# Altium project ltk-hall-main.PrjPCB (part 1 of 2)
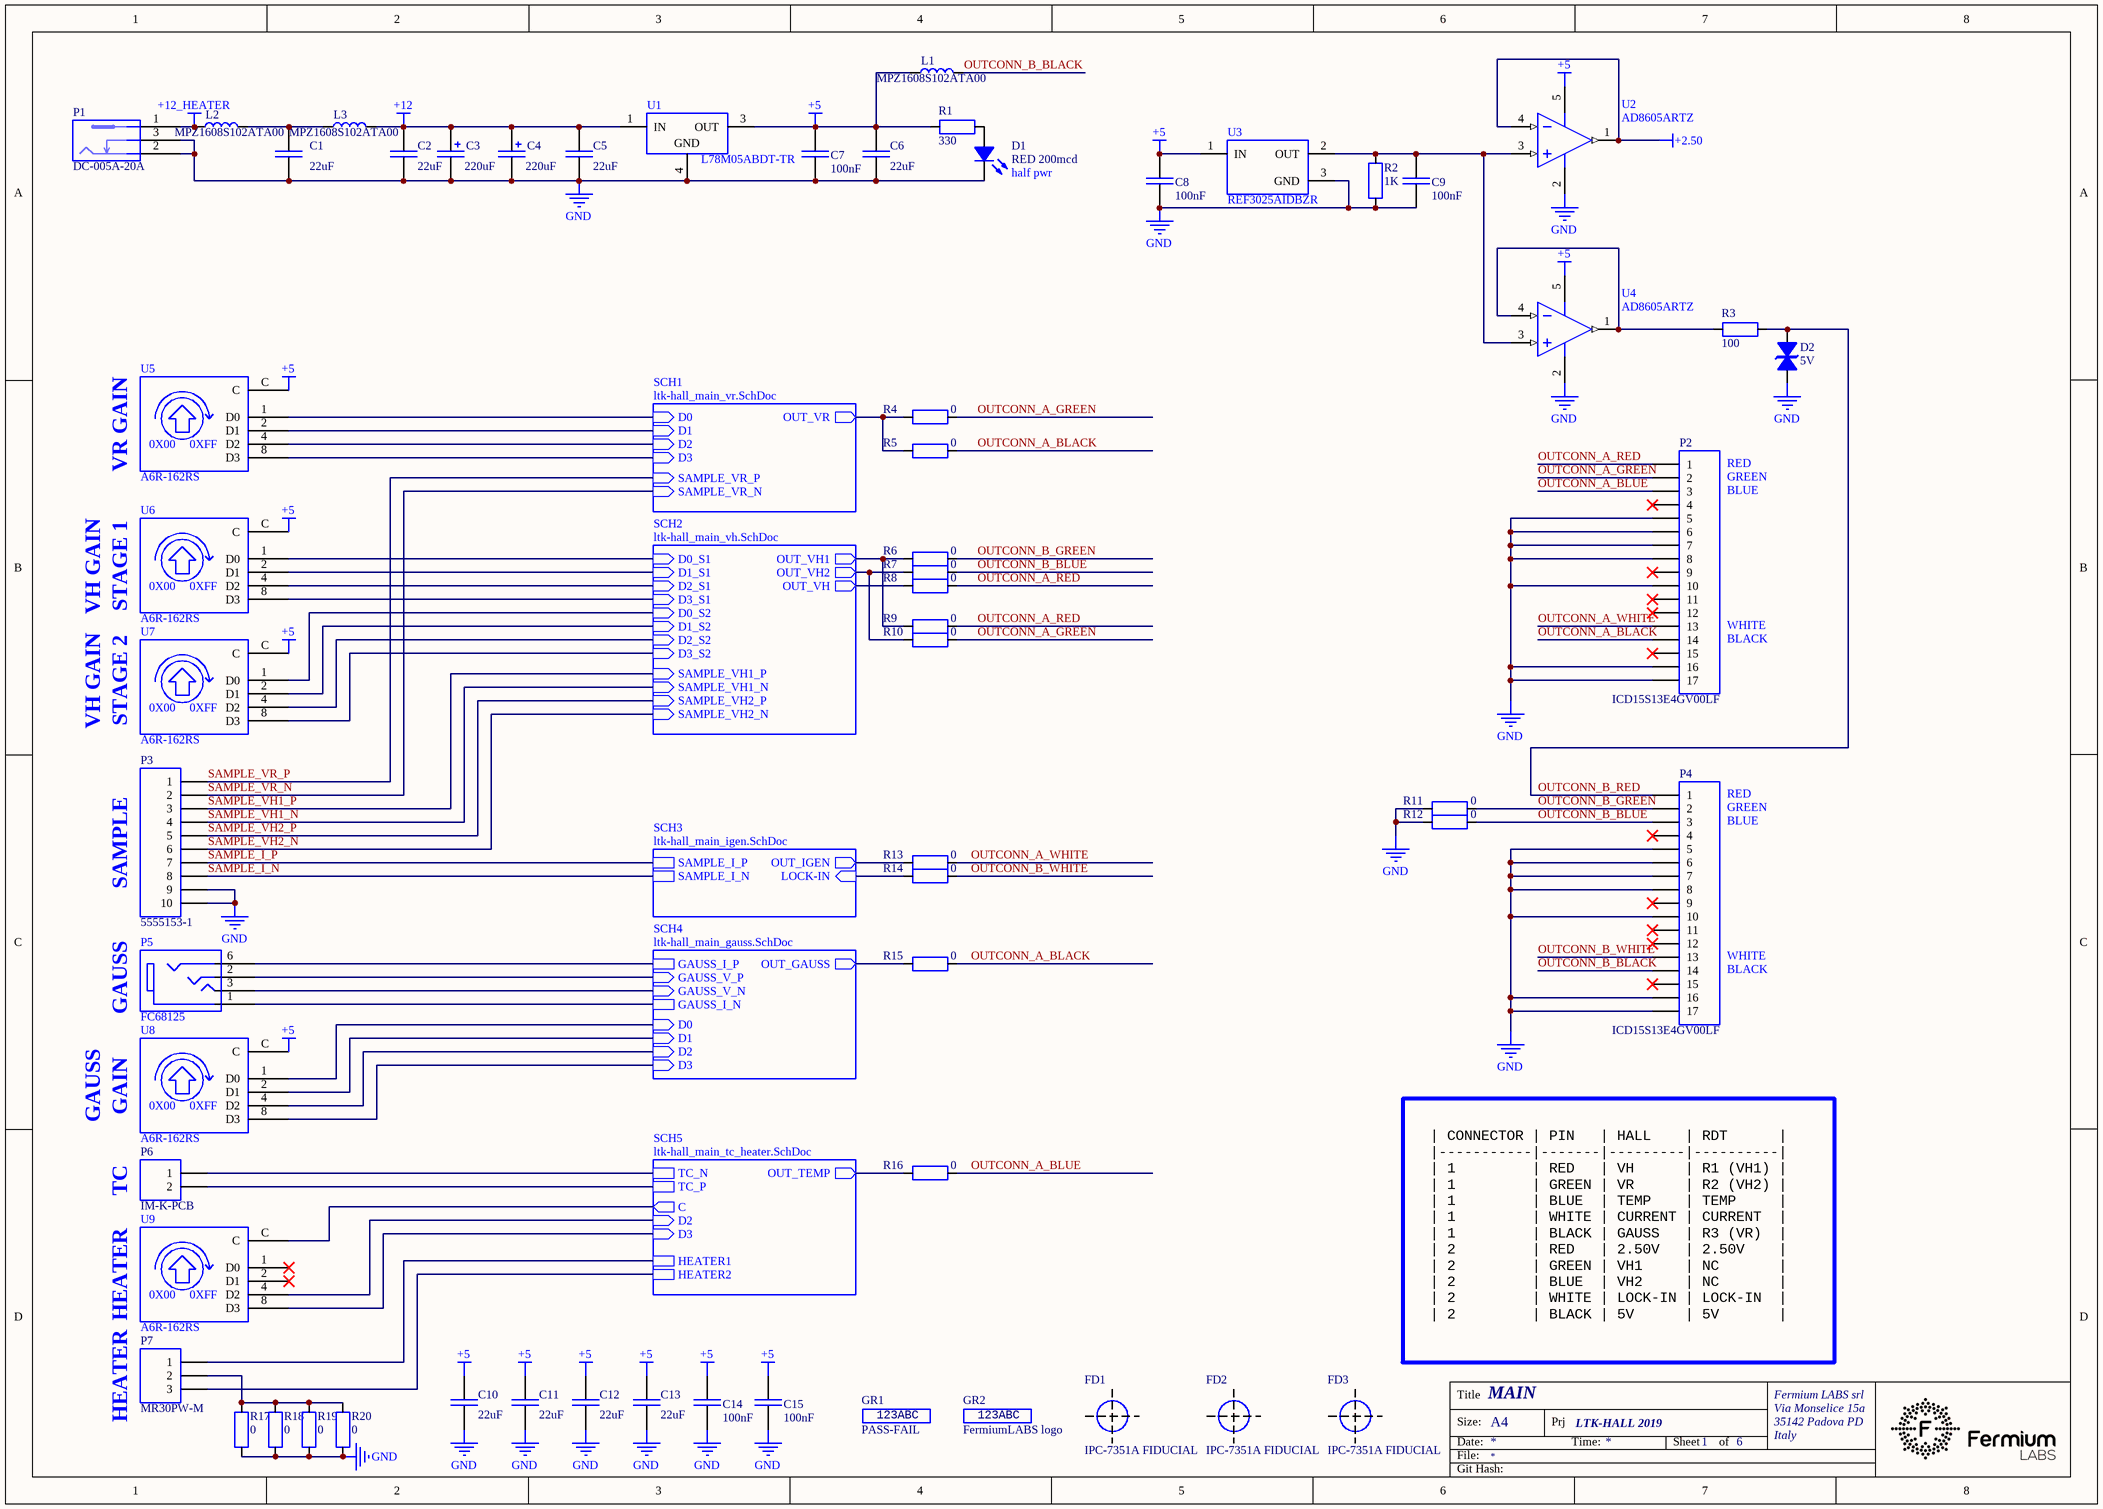
[diagram p0: ltk-hall_main.SchDoc]
ProjectTitle: LTK-HALL 2019
6 sheets, 210 parts. Net scope: hierarchical (ports join the sheet entries above them; power ports are global).
Board file: ltk-hall-main.PcbDoc
Sheets:
  ltk-hall_main.SchDoc
    SCH3 = ltk-hall_main_igen.SchDoc
    SCH4 = ltk-hall_main_gauss.SchDoc
    SCH2 = ltk-hall_main_vh.SchDoc
    SCH5 = ltk-hall_main_tc_heater.SchDoc
    SCH1 = ltk-hall_main_vr.SchDoc

## Sheet ltk-hall_main.SchDoc: MAIN
size A3; Organization: Altium Limited; Address1: L3, 12a Rodborough Rd; Address2: Frenchs Forest; Address3: NSW; Address4: Australia 2086; DocumentNumber: 1; SheetNumber: 1; SheetTotal: 6

### Parts
C1  22uF  [CAP 0805_2012]
C2  22uF  [CAP 0805_2012]
C3  220uF  [3924B366-8672-45E9-B0BE-62DACC24E783]
C4  220uF  [3924B366-8672-45E9-B0BE-62DACC24E783]
C5  22uF  [CAP 0805_2012]
C6  22uF  [CAP 0805_2012]
C7  100nF  [CAP 0603_1608]
C8  100nF  [CAP 0603_1608]
C9  100nF  [CAP 0603_1608]
C10  22uF  [CAP 0805_2012]
C11  22uF  [CAP 0805_2012]
C12  22uF  [CAP 0805_2012]
C13  22uF  [CAP 0805_2012]
C14  100nF  [CAP 0603_1608]
C15  100nF  [CAP 0603_1608]
D1  RED 200mcd  [ED49B4F6-595F-4D62-96BB-D7184CAA9B94]
D2  5V  [SOD523F]
FD1  IPC-7351A FIDUCIAL  [FIDUCIAL-IPC-7351A]  (no BOM)
FD2  IPC-7351A FIDUCIAL  [FIDUCIAL-IPC-7351A]  (no BOM)
FD3  IPC-7351A FIDUCIAL  [FIDUCIAL-IPC-7351A]  (no BOM)
GR1  PASS-FAIL  [0B1556B7-A534-4801-B57D-01EFA34B1205]  (no BOM)
GR2  FermiumLABS logo  [5394DE47-A0E8-4329-8464-7791B7C19310]  (no BOM)
L1  MPZ1608S102ATA00  [FER 0603_1608]
L2  MPZ1608S102ATA00  [FER 0603_1608]
L3  MPZ1608S102ATA00  [FER 0603_1608]
P1  DC-005A-20A  [F0972D8A-C5C0-4A84-836D-A9666EE65C2D]
P2  ICD15S13E4GV00LF  [66D8AC91-DC10-42D3-BF25-693004815827]
P3  5555153-1  [03FA2727-72E9-446E-856D-3DD573B1EBDD]
P4  ICD15S13E4GV00LF  [66D8AC91-DC10-42D3-BF25-693004815827]
P5  FC68125  [977BFFC7-4CFC-4119-A8B4-AB88E5A1DB2B]
P6  IM-K-PCB  [9044FB30-693E-4780-9B0B-95C5421D70E8]
P7  MR30PW-M  [B3F23392-877C-4EEC-B1AF-B260E8D92153]
R1  330  [RES 0603_1608]
R2  1K  [RES 0603_1608]
R3  100  [RES 0603_1608]
R4  0  [RES 0603_1608]
R5  0  [RES 0603_1608]
R6  0  [RES 0603_1608]
R7  0  [RES 0603_1608]
R8  0  [RES 0603_1608]
R9  0  [RES 0603_1608]
R10  0  [RES 0603_1608]
R11  0  [RES 0603_1608]
R12  0  [RES 0603_1608]
R13  0  [RES 0603_1608]
R14  0  [RES 0603_1608]
R15  0  [RES 0603_1608]
R16  0  [RES 0603_1608]
R17  0  [RES 0603_1608]
R18  0  [RES 0603_1608]
R19  0  [RES 0603_1608]
R20  0  [RES 0603_1608]
U1  L78M05ABDT-TR  [4BDA507D-BB70-4009-B963-85AD90086B51]
U2  AD8605ARTZ  [A3DDA0BC-073E-4B18-9613-F713A7EC1E27]
U3  REF3025AIDBZR  [TI SOT-23-3 DBZ]
U4  AD8605ARTZ  [A3DDA0BC-073E-4B18-9613-F713A7EC1E27]
U5  A6R-162RS  [2599C238-5645-4A8C-8BF9-C7515FACCFA0]
U6  A6R-162RS  [2599C238-5645-4A8C-8BF9-C7515FACCFA0]
U7  A6R-162RS  [2599C238-5645-4A8C-8BF9-C7515FACCFA0]
U8  A6R-162RS  [2599C238-5645-4A8C-8BF9-C7515FACCFA0]
U9  A6R-162RS  [2599C238-5645-4A8C-8BF9-C7515FACCFA0]

### Sub-sheets
SCH1 = ltk-hall_main_vr.SchDoc: SAMPLE_VR_P (in), SAMPLE_VR_N (in), OUT_VR (out), D1 (in), D2 (in), D0 (in), D3 (in)
SCH2 = ltk-hall_main_vh.SchDoc: SAMPLE_VH1_P (in), SAMPLE_VH1_N (in), SAMPLE_VH2_P (in), SAMPLE_VH2_N (in), OUT_VH1 (out), OUT_VH2 (out), OUT_VH (out), D1_S1 (in), D3_S1 (in), D1_S2 (in), D3_S2 (in), D0_S2 (in), D2_S1 (in), D2_S2 (in), D0_S1 (in)
SCH3 = ltk-hall_main_igen.SchDoc: OUT_IGEN (out), SAMPLE_I_P, SAMPLE_I_N, LOCK-IN (in)
SCH4 = ltk-hall_main_gauss.SchDoc: OUT_GAUSS (out), GAUSS_V_P (in), GAUSS_I_N, GAUSS_V_N (in), GAUSS_I_P, D1 (in), D0 (in), D2 (in), D3 (in)
SCH5 = ltk-hall_main_tc_heater.SchDoc: OUT_TEMP (out), TC_N, TC_P, D2 (in), D3 (in), C (out), HEATER1, HEATER2

### Nets
+2.50: U2.1(OUT) U2.4(-IN)
+5: C6.1 C7.1 C8.1 C10.1 C11.1 C12.1 C13.1 C14.1 C15.1 L1.1 R1.1 U1.3(OUT) U2.5(+V) U3.1(IN) U4.5(+V) U5.C U6.C U7.C U8.C
+12: C2.1 C3.1 C4.1 C5.1 L3.2 U1.1(IN)
+12_HEATER: L2.1 P1.1
GND: C1.2 C2.2 C3.2 C4.2 C5.2 C6.2 C7.2 C8.2 C9.2 C10.2 C11.2 C12.2 C13.2 C14.2 C15.2 D1.1(K) D2.2 P1.2 P1.3 P2.5 P2.6 P2.7 P2.8 P2.10 P2.16 P2.17 P3.9 P3.10 P4.5 P4.6 P4.7 P4.8 P4.10 P4.16 P4.17 R2.1 R11.1 R12.1 R17.1 R18.1 R19.1 R20.1 U1.4(GND) U2.2(-V) U3.3(GND) U4.2(-V)
NOT_OVERTEMP: U9.C ; sheet SCH5/C
OUTCONN_A_BLACK: P2.14 R5.2 R15.2
OUTCONN_A_BLUE: P2.3 R16.2
OUTCONN_A_GREEN: P2.2 R4.2 R10.2
OUTCONN_A_RED: P2.1 R8.2 R9.2
OUTCONN_A_WHITE: P2.13 R13.2
OUTCONN_B_BLACK: L1.2 P4.14
OUTCONN_B_BLUE: P4.3 R7.2 R12.2
OUTCONN_B_GREEN: P4.2 R6.2 R11.2
OUTCONN_B_RED: D2.1 P4.1 R3.2
OUTCONN_B_WHITE: P4.13 R14.2
SAMPLE_I_N: P3.8 ; sheet SCH3/SAMPLE_I_N
SAMPLE_I_P: P3.7 ; sheet SCH3/SAMPLE_I_P
SAMPLE_VH1_N: P3.4 ; sheet SCH2/SAMPLE_VH1_N
SAMPLE_VH1_P: P3.3 ; sheet SCH2/SAMPLE_VH1_P
SAMPLE_VH2_N: P3.6 ; sheet SCH2/SAMPLE_VH2_N
SAMPLE_VH2_P: P3.5 ; sheet SCH2/SAMPLE_VH2_P
SAMPLE_VR_N: P3.2 ; sheet SCH1/SAMPLE_VR_N
SAMPLE_VR_P: P3.1 ; sheet SCH1/SAMPLE_VR_P
NetC1_1: C1.1 L2.2 L3.1
NetC9_1: C9.1 R2.2 U2.3(+IN) U3.2(OUT) U4.3(+IN)
NetD1_2: D1.2(A) R1.2
NetD3_1: R15.1 ; sheet SCH4/OUT_GAUSS
NetD5_1: R13.1 ; sheet SCH3/OUT_IGEN
NetD6_1: R16.1 ; sheet SCH5/OUT_TEMP
NetD13_1: R6.1 R9.1 ; sheet SCH2/OUT_VH1
NetD14_1: R8.1 ; sheet SCH2/OUT_VH
NetD15_1: R7.1 R10.1 ; sheet SCH2/OUT_VH2
NetD16_1: R4.1 R5.1 ; sheet SCH1/OUT_VR
NetK1_NO: P7.1 ; sheet SCH5/HEATER1
NetK2_NO: P7.3 ; sheet SCH5/HEATER2
NetP5_1: P5.1 ; sheet SCH4/GAUSS_I_N
NetP5_2: P5.2 ; sheet SCH4/GAUSS_V_P
NetP5_3: P5.3 ; sheet SCH4/GAUSS_V_N
NetP5_6: P5.6 ; sheet SCH4/GAUSS_I_P
NetP6_1: P6.1 ; sheet SCH5/TC_N
NetP6_2: P6.2 ; sheet SCH5/TC_P
NetP7_2: P7.2 R17.2 R18.2 R19.2 R20.2
NetR3_1: R3.1 U4.1(OUT) U4.4(-IN)
NetR14_1: R14.1 ; sheet SCH3/LOCK-IN
NetR27_2: U8.1(D0) ; sheet SCH4/D0
NetR28_2: U8.2(D1) ; sheet SCH4/D1
NetR29_2: U8.4(D2) ; sheet SCH4/D2
NetR30_2: U8.8(D3) ; sheet SCH4/D3
NetR52_1: U9.8(D3) ; sheet SCH5/D3
NetR57_2: U9.4(D2) ; sheet SCH5/D2
NetR78_2: U6.1(D0) ; sheet SCH2/D0_S1
NetR79_2: U6.2(D1) ; sheet SCH2/D1_S1
NetR80_2: U6.4(D2) ; sheet SCH2/D2_S1
NetR81_2: U6.8(D3) ; sheet SCH2/D3_S1
NetR82_2: U7.1(D0) ; sheet SCH2/D0_S2
NetR83_2: U7.2(D1) ; sheet SCH2/D1_S2
NetR84_2: U7.4(D2) ; sheet SCH2/D2_S2
NetR85_2: U7.8(D3) ; sheet SCH2/D3_S2
NetR87_2: U5.1(D0) ; sheet SCH1/D0
NetR88_2: U5.2(D1) ; sheet SCH1/D1
NetR89_2: U5.4(D2) ; sheet SCH1/D2
NetR90_2: U5.8(D3) ; sheet SCH1/D3

Not connected (* = marked no-connect by the designer): P2 4* 9* 11* 12* 15*; P4 4* 9* 11* 12* 15*; U9 1(D0)* 2(D1)*

### Notes on the sheet
- (near D1) half pwr
- VR GAIN
- (near P2) GREEN
- (near P2) BLUE
- (near P2) RED
- VH GAIN
- STAGE 1
- (near P2) WHITE
- (near P2) BLACK
- STAGE 2
- (near P3) SAMPLE
- (near P4) GREEN
- (near P4) BLUE
- (near P4) RED
- GAUSS
- (near P4) WHITE
- (near P4) BLACK
- GAIN
- (near P6) TC
- HEATER
- (near P7) HEATER
- | CONNECTOR | PIN   | HALL    | RDT      |
  |-----------|-------|---------|----------|
  | 1         | RED   | VH      | R1 (VH1) |
  | 1         | GREEN | VR      | R2 (VH2) |
  | 1         | BLUE  | TEMP    | TEMP     |
  | 1         | WHITE | CURRENT | CURRENT  |
  | 1         | BLACK | GAUSS   | R3 (VR)  |
  | 2         | RED   | 2.50V   | 2.50V    |
  | 2         | GREEN | VH1     | NC       |
  | 2         | BLUE  | VH2     | NC       |
  | 2         | WHITE | LOCK-IN | LOCK-IN  |
  | 2         | BLACK | 5V      | 5V       |
- Title
- Fermium LABS srl
- Size:
- Date:
- File:
- A4
- Prj
- Time:
- Sheet
- of
- Via Monselice 15a
- 35142 Padova PD
- Italy
- Git Hash:
- (in symbol 50f8ea88-0034-49fe-a263-d8e97bc35e2f) 123ABC
- (in symbol bbf157ad-cd7a-4e82-97e3-d6a037590888) 0X00; 0XFF
- (in symbol d1abe19f-3fed-4f20-b2ed-afc0ffbc6628) 123ABC

### Library data of the parts
C1 C2 C5 C6 C10-C13 = 4e18e584-a077-4dfe-b9da-5e528e787323: CAP SMD MLCC 22uF 25V 0805 X5R; Manufacturer 1: Samsung Electro-Mechanics; Manufacturer Part Number 1: CL21A106KAYNNNE; id: 14817; S 1: LCSC; SPN 1: C84416; SPN 2: C15850; Part Number: 4e18e584-a077-4dfe-b9da-5e528e787323; Manufacturer 2: Murata; Manufacturer Part Number 2: GRM21BR61E106KA73L; Value: 22uF; S 2: LCSC
C3 C4 = 1a28df19-6d3e-4a71-836c-f22920f8e8ab: CAP  THT ELEC 220uF 25V 20%; Manufacturer 1: Rubycon; Manufacturer Part Number 1: 25PK220MEFC-6.3*11; id: 14782; S 1: LCSC; SPN 1: C109337; Part Number: 1a28df19-6d3e-4a71-836c-f22920f8e8ab; ComponentLink1Description: Datasheet; ComponentLink1URL: http://localhost:8080/static/files/Rubycon-220uF-25V_C109337_12019-03-10_214953.757848.pdf?Rubycon-220uF-25V_C109337 (1).pdf; Value: 220uF
C7-C9 C14 C15 = 02841f84-ac15-41b5-9e17-915f8f067828: CAP SMD MLCC 100nF 25V 0603 X7R; Manufacturer 1: Samsung Electro-Mechanics; Manufacturer Part Number 1: CL10B104KA8NNNC; id: 14784; S 1: LCSC; SPN 1: C1590; SPN 2: C14663; Part Number: 02841f84-ac15-41b5-9e17-915f8f067828; ComponentLink1Description: Datasheet; ComponentLink1URL: http://localhost:8080/static/files/Samsung-Electro-Mechanics-CL10B104KA8NNNC_C15902019-03-10_215548.826887.pdf?Samsung-Electro-Mechanics-CL10B104KA8NNNC_C1590.pdf; Value: 100nF; Manufacturer 2: Yageo; Manufacturer Part Number 2: CC0603KRX7R9BB104; S 2: LCSC
D1 = c65ae3d2-9539-4634-8979-616a331b7494: DIODE LED THT 5MM RED 200mcd; Manufacturer 1: Everlight; Manufacturer Part Number 1: 333-2SURD/S530-A3-L; id: 14851; S 1: LCSC; SPN 1: C99758; Part Number: c65ae3d2-9539-4634-8979-616a331b7494; ComponentLink1Description: Datasheet; ComponentLink1URL: http://localhost:8080/static/files/Everlight-Elec-333-2SURD-S530-A3-L_C997582019-08-18_181624.501044.pdf?Everlight-Elec-333-2SURD-S530-A3-L_C99758.pdf; Value: RED 200mcd
D2 = daa58212-38e2-4326-a156-8e48058c46f1: DIODE SMD TVS 5V BIDIRECTIONAL SOD-523; Manufacturer 1: Born Semiconductor; Manufacturer Part Number 1: PESD5V0S1BBN; id: 14837; S 1: LCSC; SPN 1: C314264; SPN 2: C97640; Part Number: daa58212-38e2-4326-a156-8e48058c46f1; ComponentLink1Description: Datasheet; ComponentLink1URL: http://localhost:8080/static/files/Nexperia-PESD5V0S1BB-115_C976402019-08-16_201905.624024.pdf?Nexperia-PESD5V0S1BB-115_C97640.pdf; ComponentLink2Description: Datasheet; ComponentLink2URL: http://localhost:8080/static/files/1901051701_Bourne-Semicon-Shenzhen-PESD5V0S1BBN_C3142642019-08-16_201911.992552.pdf?1901051701_Bourne-Semicon-Shenzhen-PESD5V0S1BBN_C314264.pdf; Manufacturer 2: Nexperia; Manufacturer Part Number 2: PESD5V0S1BB,115; Value: 5V; S 2: LCSC
FD1-FD3 = 19da4612-eb95-43bb-9984-553a52b2a224: GRAPHICS FIDUCIAL IPC-7351A; id: 14800; Part Number: 19da4612-eb95-43bb-9984-553a52b2a224
GR1 = d1abe19f-3fed-4f20-b2ed-afc0ffbc6628: GRAPHICS PASS-FAIL MARK; id: 14801; Part Number: d1abe19f-3fed-4f20-b2ed-afc0ffbc6628
GR2 = 50f8ea88-0034-49fe-a263-d8e97bc35e2f: GRAPHICS LOGO FERMIUM LABS SRL; id: 14799; Part Number: 50f8ea88-0034-49fe-a263-d8e97bc35e2f
L1-L3 = a4b2e015-bf25-47b8-954c-a5b040744a3a: FER SMD CHIP 0603 800mA 1K@100MHz 300mOhm; Manufacturer 1: TDK; id: 14850; S 1: LCSC; SPN 1: C76814; Part Number: a4b2e015-bf25-47b8-954c-a5b040744a3a; ComponentLink1Description: Datasheet; ComponentLink1URL: http://localhost:8080/static/files/TDK-MPZ1608S102ATA00_C768142019-08-18_021255.210641.pdf?TDK-MPZ1608S102ATA00_C76814.pdf; Manufacturer Part Number 1: MPZ1608S102ATA00
P1 = b53db51a-1725-412b-9039-fa7a45c7c438: CONN THT DC JACK 0.5A 30VDC 5Kcycles; Manufacturer 1: HRO Electronics; id: 14780; S 1: LCSC; SPN 1: C191049; Part Number: b53db51a-1725-412b-9039-fa7a45c7c438; ComponentLink1Description: Datasheet; ComponentLink1URL: http://localhost:8080/static/files/Korean-Hroparts-Elec-DC-005A-20A_C191049_22019-03-10_214231.486078.pdf?Korean-Hroparts-Elec-DC-005A-20A_C191049 (2).pdf; Manufacturer Part Number 1: DC-005A-20A
P2 P4 = af155709-b835-40ac-b9b5-4a44b0fd2777: CONN D-SUB HD 15POLES BLACK THT; Manufacturer 1: FCI; id: 14838; S 1: TME; Part Number: af155709-b835-40ac-b9b5-4a44b0fd2777; ComponentLink1Description: Mechanical Drawing; ComponentLink1URL: http://localhost:8080/static/files/c-cd-00112019-08-16_203054.958624.pdf?c-cd-0011.pdf; ComponentLink2Description: Datasheet; ComponentLink2URL: http://localhost:8080/static/files/io_dsub_highdensity2019-08-16_203112.582695.pdf?io_dsub_highdensity.pdf; Manufacturer Part Number 1: ICD15S13E4GV00LF; SPN 1: ICD15S13E4GV00LF
P3 = f401b84a-9695-45b1-951e-00bef0039069: CONN RJ45 SHIELDED; Manufacturer 1: TE Connectivity; id: 14843; S 1: LCSC; SPN 1: C125072; Part Number: f401b84a-9695-45b1-951e-00bef0039069; ComponentLink1Description: Product Page; ComponentLink1URL: https://www.te.com/usa-en/product-5555153-1.html?te_campaign=oct_glo_manufacturer&elqCampaignId=26136&te_bu=Cor&te_type=other; ComponentLink2Description: Datasheet; ComponentLink2URL: http://localhost:8080/static/files/TE-Connectivity-5555153-1_C1250722019-08-17_152708.984028.pdf?TE-Connectivity-5555153-1_C125072.pdf; ComponentLink3Description: 3D Model; ComponentLink3URL: http://localhost:8080/static/files/ENG_CVM_CVM_5555153-1_C.3d_stp2019-08-17_152716.824354.zip?ENG_CVM_CVM_5555153-1_C.3d_stp.zip; Manufacturer Part Number 1: 5555153-1
P5 = 3e3c57e9-f1b8-4c12-8bb1-97da9eb9c220: CONN JACK 3.5MM 4POLE THT; Manufacturer 1: Cliff; id: 14844; S 1: TME; Part Number: 3e3c57e9-f1b8-4c12-8bb1-97da9eb9c220; ComponentLink1Description: Datasheet; ComponentLink1URL: http://localhost:8080/static/files/Cliff-FC68125-datasheet2019-08-17_161810.238588.pdf?Cliff-FC68125-datasheet.pdf; Manufacturer Part Number 1: FC68125; SPN 1: FC68125
P6 = 44088476-53fa-4578-a611-1fd63affe7b4: CONN THERMOCOUPLE K-TYPE THT; Manufacturer 1: Labfacility; id: 14845; S 1: Farnell; SPN 1: 3810628; Part Number: 44088476-53fa-4578-a611-1fd63affe7b4; ComponentLink1Description: Datasheet; ComponentLink1URL: http://localhost:8080/static/files/28420972019-08-17_162400.037613.pdf?2842097.pdf; Manufacturer Part Number 1: IM-K-PCB
P7 = 8565bfd1-7a71-455a-a363-4ce9dda60de6: CONN DC 3 POLE 15A PCB MALE; Manufacturer 1: Changzhou Amass Elec; id: 14833; S 1: TME; Part Number: 8565bfd1-7a71-455a-a363-4ce9dda60de6; ComponentLink1Description: Datasheet; ComponentLink1URL: http://localhost:8080/static/files/MR30PW_SPEC2019-08-16_190138.191607.pdf?MR30PW SPEC.pdf; ComponentLink2Description: 3D Model; ComponentLink2URL: http://localhost:8080/static/files/B3F23392-877C-4EEC-B1AF-B260E8D921532019-08-16_190154.620416.step?B3F23392-877C-4EEC-B1AF-B260E8D92153.step; Manufacturer Part Number 1: MR30PW-M; SPN 1: MR30PW-M
R1 = e8555d7b-eeda-4727-b2e1-550cdc03d819: RES SMD 330 OHM 1% 1/10W 0603; Manufacturer 1: Yageo; Manufacturer Part Number 1: RC0603FR-07330RL; id: 12350; S 1: LCSC; SPN 1: C105881; SPN 2: C23138; Part Number: e8555d7b-eeda-4727-b2e1-550cdc03d819; Value: 330; Manufacturer 2: Uniroyal; Manufacturer Part Number 2: 0603WAF3300T5E; S 2: LCSC
R2 = a678220f-9e9d-4863-a833-9993504f723c: RES SMD 1K OHM 1% 1/10W 0603; Manufacturer 1: Yageo; Manufacturer Part Number 1: RC0603FR-071KL; id: 14794; S 1: LCSC; SPN 1: C21190; SPN 2: C22548; Part Number: a678220f-9e9d-4863-a833-9993504f723c; Value: 1K; Manufacturer 2: Uniroyal; Manufacturer Part Number 2: 0603WAF1001T5E; S 2: LCSC
R3 = 0a6c4b74-f837-4563-b154-6e196d753525: RES SMD 100 OHM 1% 1/10W 0603; Manufacturer 1: Yageo; Manufacturer Part Number 1: RC0603FR-07100RL; id: 12301; S 1: LCSC; SPN 1: C105588; SPN 2: C22775; Part Number: 0a6c4b74-f837-4563-b154-6e196d753525; Value: 100; Manufacturer 2: Uniroyal; Manufacturer Part Number 2: 0603WAF1000T5E; S 2: LCSC
R4-R20 = 6ae227f9-847f-4766-8522-e11a83531204: RES SMD 0 OHM 5% 1/10W 0603; Manufacturer 1: Yageo; Manufacturer Part Number 1: RC0603JR-070RL; id: 11973; S 1: LCSC; SPN 1: C95177; SPN 2: C21189; Part Number: 6ae227f9-847f-4766-8522-e11a83531204; Value: 0; Manufacturer 2: Uniroyal; Manufacturer Part Number 2: 0603WAF0000T5E; S 2: LCSC
U1 = 446536aa-1bdd-4764-8cae-49f4e0c126ff: IC SMD LINEAR VOLTAGE REGULATOR 5V 500mA DPAK/TO-252; Manufacturer 1: ST Microelectronics; id: 14848; S 1: LCSC; SPN 1: C58069; Part Number: 446536aa-1bdd-4764-8cae-49f4e0c126ff; ComponentLink1Description: Datasheet; ComponentLink1URL: http://localhost:8080/static/files/STMicroelectronics-L78M05ABDT-TR_C580692019-08-17_184424.026041.pdf?STMicroelectronics-L78M05ABDT-TR_C58069.pdf; Manufacturer Part Number 1: L78M05ABDT-TR
U2 U4 = 5610e9ea-bca8-49b2-8e5f-11409231f6a4: IC OPAMP 65uV 1pA RRIO 5V 80mA SOT-23-5; Manufacturer 1: Analog Devices; id: 14830; S 1: LCSC; SPN 1: C9641; Part Number: 5610e9ea-bca8-49b2-8e5f-11409231f6a4; ComponentLink1Description: Datasheet; ComponentLink1URL: http://localhost:8080/static/files/Analog_Devices-AD8605ARTZ-REEL7-datasheet2019-08-16_175825.352099.pdf?Analog_Devices-AD8605ARTZ-REEL7-datasheet.pdf; Manufacturer Part Number 1: AD8605ARTZ
U3 = 0de0df07-6dfd-42d8-9fe7-171c27772811: IC VOLTAGE REF SERIES 2.5V 75ppm 0.2% SOT-23; Manufacturer 1: Texas Instruments; id: 14831; S 1: LCSC; SPN 1: C11334; Part Number: 0de0df07-6dfd-42d8-9fe7-171c27772811; ComponentLink1Description: Datasheet; ComponentLink1URL: http://localhost:8080/static/files/Texas-Instruments-TI-REF3025AIDBZR_C113342019-08-16_180357.548624.pdf?Texas-Instruments-TI-REF3025AIDBZR_C11334.pdf; Manufacturer Part Number 1: REF3025AIDBZR
U5-U9 = bbf157ad-cd7a-4e82-97e3-d6a037590888: SWITCH ROTARY HEX/BCD 16 POSITIONS; Manufacturer 1: Omron; id: 14834; S 1: TME; Part Number: bbf157ad-cd7a-4e82-97e3-d6a037590888; ComponentLink1Description: Datasheet; ComponentLink1URL: http://localhost:8080/static/files/A6R-A6RV2019-08-16_190638.241287.PDF?A6R-A6RV.PDF; ComponentLink2Description: 3D Model; ComponentLink2URL: http://localhost:8080/static/files/2599C238-5645-4A8C-8BF9-C7515FACCFA02019-08-16_192704.487115.step?2599C238-5645-4A8C-8BF9-C7515FACCFA0.step; Manufacturer Part Number 1: A6R-162RS; SPN 1: A6R-162RS

## Sheet ltk-hall_main_igen.SchDoc: MAIN / CURRENT GEN.
size A3; Organization: Altium Limited; Address1: L3, 12a Rodborough Rd; Address2: Frenchs Forest; Address3: NSW; Address4: Australia 2086; DocumentNumber: 3; SheetNumber: 3; SheetTotal: 6
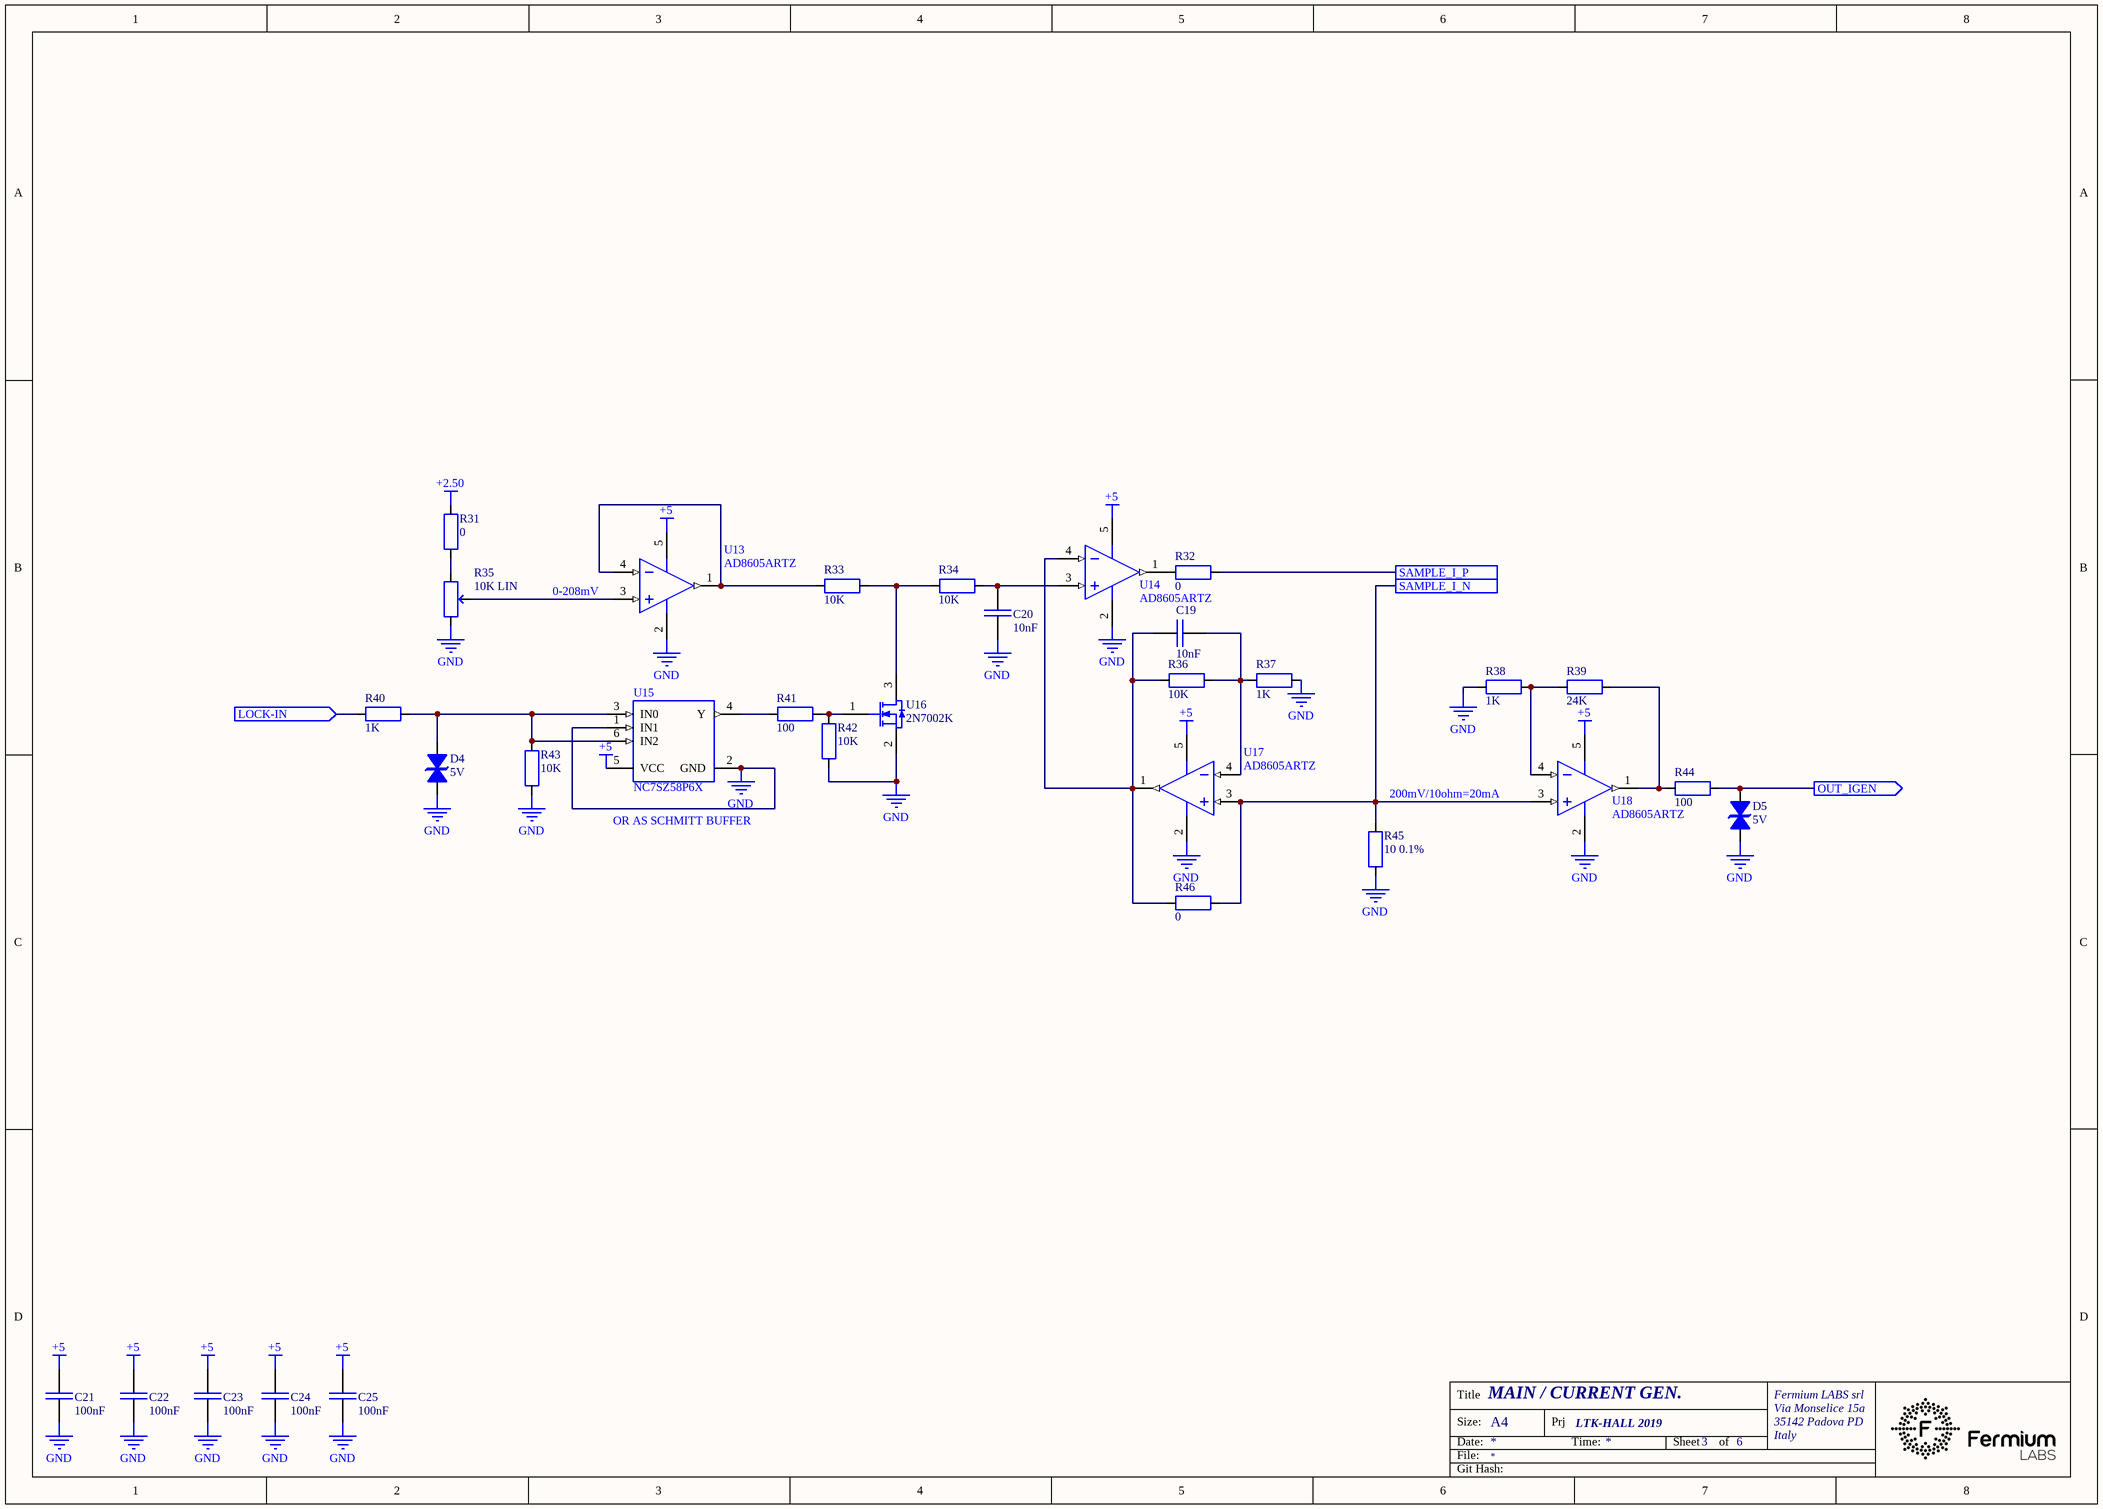
[diagram p1: ltk-hall_main_igen.SchDoc]

### Parts
C19  10nF  [CAP 0603_1608]
C20  10nF  [CAP 0603_1608]
C21  100nF  [CAP 0603_1608]
C22  100nF  [CAP 0603_1608]
C23  100nF  [CAP 0603_1608]
C24  100nF  [CAP 0603_1608]
C25  100nF  [CAP 0603_1608]
D4  5V  [SOD523F]
D5  5V  [SOD523F]
R31  0  [RES 0603_1608]
R32  0  [RES 0603_1608]
R33  10K  [RES 0603_1608]
R34  10K  [RES 0603_1608]
R35  10K LIN  [2EF88547-EDEF-4A49-A522-C215618D4BC7]
R36  10K  [RES 0603_1608]
R37  1K  [RES 0603_1608]
R38  1K  [RES 0603_1608]
R39  24K  [RES 0603_1608]
R40  1K  [RES 0603_1608]
R41  100  [RES 0603_1608]
R42  10K  [RES 0603_1608]
R43  10K  [RES 0603_1608]
R44  100  [RES 0603_1608]
R45  10 0.1%  [RES 0603_1608]
R46  0  [RES 0603_1608]
U13  AD8605ARTZ  [A3DDA0BC-073E-4B18-9613-F713A7EC1E27]
U14  AD8605ARTZ  [A3DDA0BC-073E-4B18-9613-F713A7EC1E27]
U15  NC7SZ58P6X  [CF792C6F-51F3-4C59-9918-AD84EFC14FA6]
U16  2N7002K  [ON SEMI SOT-23-3]
U17  AD8605ARTZ  [A3DDA0BC-073E-4B18-9613-F713A7EC1E27]
U18  AD8605ARTZ  [A3DDA0BC-073E-4B18-9613-F713A7EC1E27]

### Ports
LOCK-IN (in), OUT_IGEN (out), SAMPLE_I_N, SAMPLE_I_P

### Nets
+2.50: R31.2
+5: C21.1 C22.1 C23.1 C24.1 C25.1 U13.5(+V) U14.5(+V) U15.5(VCC) U17.5(+V) U18.5(+V)
GND: C20.2 C21.2 C22.2 C23.2 C24.2 C25.2 D4.2 D5.2 R35.3 R37.2 R38.1 R42.1 R43.1 R45.1 U13.2(-V) U14.2(-V) U15.1(IN1) U15.2(GND) U16.2(S) U17.2(-V) U18.2(-V)
SAMPLE_I_N: R45.2 R46.2 U17.3(+IN) U18.3(+IN) ; port SAMPLE_I_N
SAMPLE_I_P: R32.2 ; port SAMPLE_I_P
NetC19_1: C19.1 R36.2 R46.1 U14.4(-IN) U17.1(OUT)
NetC19_2: C19.2 R36.1 R37.1 U17.4(-IN)
NetC20_1: C20.1 R34.1 U14.3(+IN)
NetD4_1: D4.1 R40.1 R43.2 U15.3(IN0) U15.6(IN2)
NetD5_1: D5.1 R44.2 ; port OUT_IGEN
NetR14_1: R40.2 ; port LOCK-IN
NetR31_1: R31.1 R35.1
NetR32_1: R32.1 U14.1(OUT)
NetR33_1: R33.1 R34.2 U16.3(D)
NetR33_2: R33.2 U13.1(OUT) U13.4(-IN)
NetR35_2: R35.2 U13.3(+IN)
NetR38_2: R38.2 R39.1 U18.4(-IN)
NetR39_2: R39.2 R44.1 U18.1(OUT)
NetR41_1: R41.1 U15.4(Y)
NetR41_2: R41.2 R42.2 U16.1(G)

### Notes on the sheet
- (near U13) 0-208mV
- (near U15) OR AS SCHMITT BUFFER
- (near R45) 200mV/10ohm=20mA
- Title
- Fermium LABS srl
- Size:
- Date:
- File:
- A4
- Prj
- Time:
- Sheet
- of
- Via Monselice 15a
- 35142 Padova PD
- Italy
- Git Hash:

### Library data of the parts
C19 C20 = 84e1ebe1-2230-4987-8231-c47d83fa5f7f: CAP SMD MLCC 10nF 50V 0603 X7R; Manufacturer 1: Yageo; Manufacturer Part Number 1: CC0603KRX7R9BB103; id: 14853; S 1: LCSC; SPN 1: C307477; SPN 2: C100042; Part Number: 84e1ebe1-2230-4987-8231-c47d83fa5f7f; ComponentLink1Description: Datasheet; ComponentLink1URL: http://localhost:8080/static/files/Samsung-Electro-Mechanics-CL10B103KB8NFNC_C3074772019-08-20_080422.792510.pdf?Samsung-Electro-Mechanics-CL10B103KB8NFNC_C307477.pdf; ComponentLink2Description: Datasheet; ComponentLink2URL: http://localhost:8080/static/files/YAGEO-CC0603KRX7R9BB103_C1000422019-08-20_080430.121676.pdf?YAGEO-CC0603KRX7R9BB103_C100042.pdf; Manufacturer 2: Samsung Electro-Mechanics; Manufacturer 3: Yageo; Manufacturer Part Number 2: CL10B103KB8NFNC; Manufacturer Part Number 3: CC0603JRX7R9BB103; Value: 10nF; S 2: LCSC
C21-C25 = 02841f84-ac15-41b5-9e17-915f8f067828: as C7 on sheet ltk-hall_main; Part Number: 02841f84-ac15-41b5-9e17-915f8f067828; ComponentLink1Description: Datasheet; ComponentLink1URL: http://localhost:8080/static/files/Samsung-Electro-Mechanics-CL10B104KA8NNNC_C15902019-03-10_215548.826887.pdf?Samsung-Electro-Mechanics-CL10B104KA8NNNC_C1590.pdf; Value: 100nF; Manufacturer 2: Yageo; Manufacturer Part Number 2: CC0603KRX7R9BB104; S 2: LCSC
D4 D5 = daa58212-38e2-4326-a156-8e48058c46f1: as D2 on sheet ltk-hall_main; Part Number: daa58212-38e2-4326-a156-8e48058c46f1; ComponentLink1Description: Datasheet; ComponentLink1URL: http://localhost:8080/static/files/Nexperia-PESD5V0S1BB-115_C976402019-08-16_201905.624024.pdf?Nexperia-PESD5V0S1BB-115_C97640.pdf; ComponentLink2Description: Datasheet; ComponentLink2URL: http://localhost:8080/static/files/1901051701_Bourne-Semicon-Shenzhen-PESD5V0S1BBN_C3142642019-08-16_201911.992552.pdf?1901051701_Bourne-Semicon-Shenzhen-PESD5V0S1BBN_C314264.pdf; Manufacturer 2: Nexperia; Manufacturer Part Number 2: PESD5V0S1BB,115; Value: 5V; S 2: LCSC
R31 R32 R46 = 6ae227f9-847f-4766-8522-e11a83531204: as R4 on sheet ltk-hall_main; Part Number: 6ae227f9-847f-4766-8522-e11a83531204; Value: 0; Manufacturer 2: Uniroyal; Manufacturer Part Number 2: 0603WAF0000T5E; S 2: LCSC
R33 R34 R36 R42 R43 = 93242766-ba1d-462d-b58f-ce1dfc4129c8: RES SMD 10K OHM 1% 1/10W 0603; Manufacturer 1: Yageo; Manufacturer Part Number 1: RC0603FR-0710KL; id: 12101; S 1: LCSC; SPN 1: C98220; SPN 2: C25804; Part Number: 93242766-ba1d-462d-b58f-ce1dfc4129c8; Value: 10K; Manufacturer 2: Uniroyal; Manufacturer Part Number 2: 0603WAF1002T5E; S 2: LCSC
R35 = 3df905ea-1e80-4add-859d-a36edd7f106c: POT 10K 20% SHAFT 6mmx7.4mm LIN; Manufacturer 1: ALPS; Manufacturer Part Number 1: RK09K1130A6S; id: 14828; S 1: LCSC; SPN 1: C209770; Part Number: 3df905ea-1e80-4add-859d-a36edd7f106c; ComponentLink1Description: 3D Model; ComponentLink1URL: http://localhost:8080/static/files/RK09K1130A6S2019-08-17_031625.830758.zip?RK09K1130A6S.zip; ComponentLink2Description: Datasheet; ComponentLink2URL: http://localhost:8080/static/files/ALPS-Electric-RK09K1130A6S_C2097702019-08-17_031651.036431.pdf?ALPS-Electric-RK09K1130A6S_C209770.pdf; Value: 10K LIN
R37 R38 R40 = a678220f-9e9d-4863-a833-9993504f723c: as R2 on sheet ltk-hall_main; Part Number: a678220f-9e9d-4863-a833-9993504f723c; Value: 1K; Manufacturer 2: Uniroyal; Manufacturer Part Number 2: 0603WAF1001T5E; S 2: LCSC
R39 = 89bb9559-07ab-4a9e-ba67-95cb66f30425: RES SMD 24K OHM 1% 1/10W 0603; Manufacturer 1: Yageo; Manufacturer Part Number 1: RC0603FR-0724KL; id: 12540; S 1: LCSC; SPN 1: C137760; Part Number: 89bb9559-07ab-4a9e-ba67-95cb66f30425; Value: 24K
R41 R44 = 0a6c4b74-f837-4563-b154-6e196d753525: as R3 on sheet ltk-hall_main; Part Number: 0a6c4b74-f837-4563-b154-6e196d753525; Value: 100; Manufacturer 2: Uniroyal; Manufacturer Part Number 2: 0603WAF1000T5E; S 2: LCSC
R45 = f0166db1-b7e4-4c18-9511-2907615c1c51: RES SMD 10 OHM 0.1% 1/16W 25ppm  0603; Manufacturer 1: Uniroyal; Manufacturer Part Number 1: TC0325B100JT5E; id: 14842; S 1: LCSC; SPN 1: C319923; SPN 2: C146565; Part Number: f0166db1-b7e4-4c18-9511-2907615c1c51; Manufacturer 2: Viking Tech; Manufacturer Part Number 2: AR03BTCX0100; Value: 10 0.1%; S 2: LCSC
U13 U14 U17 U18 = 5610e9ea-bca8-49b2-8e5f-11409231f6a4: as U2 on sheet ltk-hall_main; Part Number: 5610e9ea-bca8-49b2-8e5f-11409231f6a4; ComponentLink1Description: Datasheet; ComponentLink1URL: http://localhost:8080/static/files/Analog_Devices-AD8605ARTZ-REEL7-datasheet2019-08-16_175825.352099.pdf?Analog_Devices-AD8605ARTZ-REEL7-datasheet.pdf; Manufacturer Part Number 1: AD8605ARTZ
U15 = 22da43c7-1950-42f4-bc93-10d9cca79b4d: IC LOGIC PORT CONFIGURABLE AND, OR, NAND, NOR, XOR, BUFFER, NOT 8ns  74XX58 SC-70; Manufacturer 1: ON Semiconductor; id: 14841; S 1: LCSC; SPN 1: C232804; SPN 2: C7842; Part Number: 22da43c7-1950-42f4-bc93-10d9cca79b4d; ComponentLink1Description: Datasheet; ComponentLink1URL: http://localhost:8080/static/files/1812220431_ON-Semicon-ON-NC7SZ58P6X_C2328042019-08-17_005741.293796.pdf?1812220431_ON-Semicon-ON-NC7SZ58P6X_C232804.pdf; ComponentLink2Description: Datasheet; ComponentLink2URL: http://localhost:8080/static/files/Texas-Instruments-TI-SN74LVC1G58DCKR_C78422019-08-17_005749.189474.pdf?Texas-Instruments-TI-SN74LVC1G58DCKR_C7842.pdf; Manufacturer 2: Texas Instruments; Manufacturer Part Number 1: NC7SZ58P6X; Manufacturer Part Number 2: SN74LVC1G58DCKR; S 2: LCSC
U16 = 3a318f0a-3b94-47d9-91d5-8fc0a2f410e8: MOSFET N-CHANNEL LOGIC LEVEL 300mA 3ohm 60V ESD-PROT 2N7002K SOT-23; Manufacturer 1: ON Semiconductor; Manufacturer Part Number 1: 2N7002KT1G; id: 14846; S 1: LCSC; SPN 1: C81445; SPN 2: C116584; SPN 3: C85047; Part Number: 3a318f0a-3b94-47d9-91d5-8fc0a2f410e8; ComponentLink1Description: Datasheet; ComponentLink1URL: http://localhost:8080/static/files/ON-Semicon-ON-2N7002KT1G_C1165842019-08-17_164859.682835.pdf?ON-Semicon-ON-2N7002KT1G_C116584.pdf; ComponentLink2Description: Datasheet; ComponentLink2URL: http://localhost:8080/static/files/Vishay-Intertech-2N7002K-T1-GE3_C814452019-08-17_164907.199439.pdf?Vishay-Intertech-2N7002K-T1-GE3_C81445.pdf; ComponentLink3Description: Datasheet; ComponentLink3URL: http://localhost:8080/static/files/DATA; Manufacturer 2: Vishay; Manufacturer 3: Diodes Inc.; Manufacturer Part Number 2: 2N7002K-T1-GE3; Manufacturer Part Number 3: 2N7002K-7; S 2: LCSC; S 3: LCSC

## Sheet ltk-hall_main_gauss.SchDoc: MAIN / GAUSSMETER
size A3; Organization: Altium Limited; Address1: L3, 12a Rodborough Rd; Address2: Frenchs Forest; Address3: NSW; Address4: Australia 2086; DocumentNumber: 2; SheetNumber: 2; SheetTotal: 6
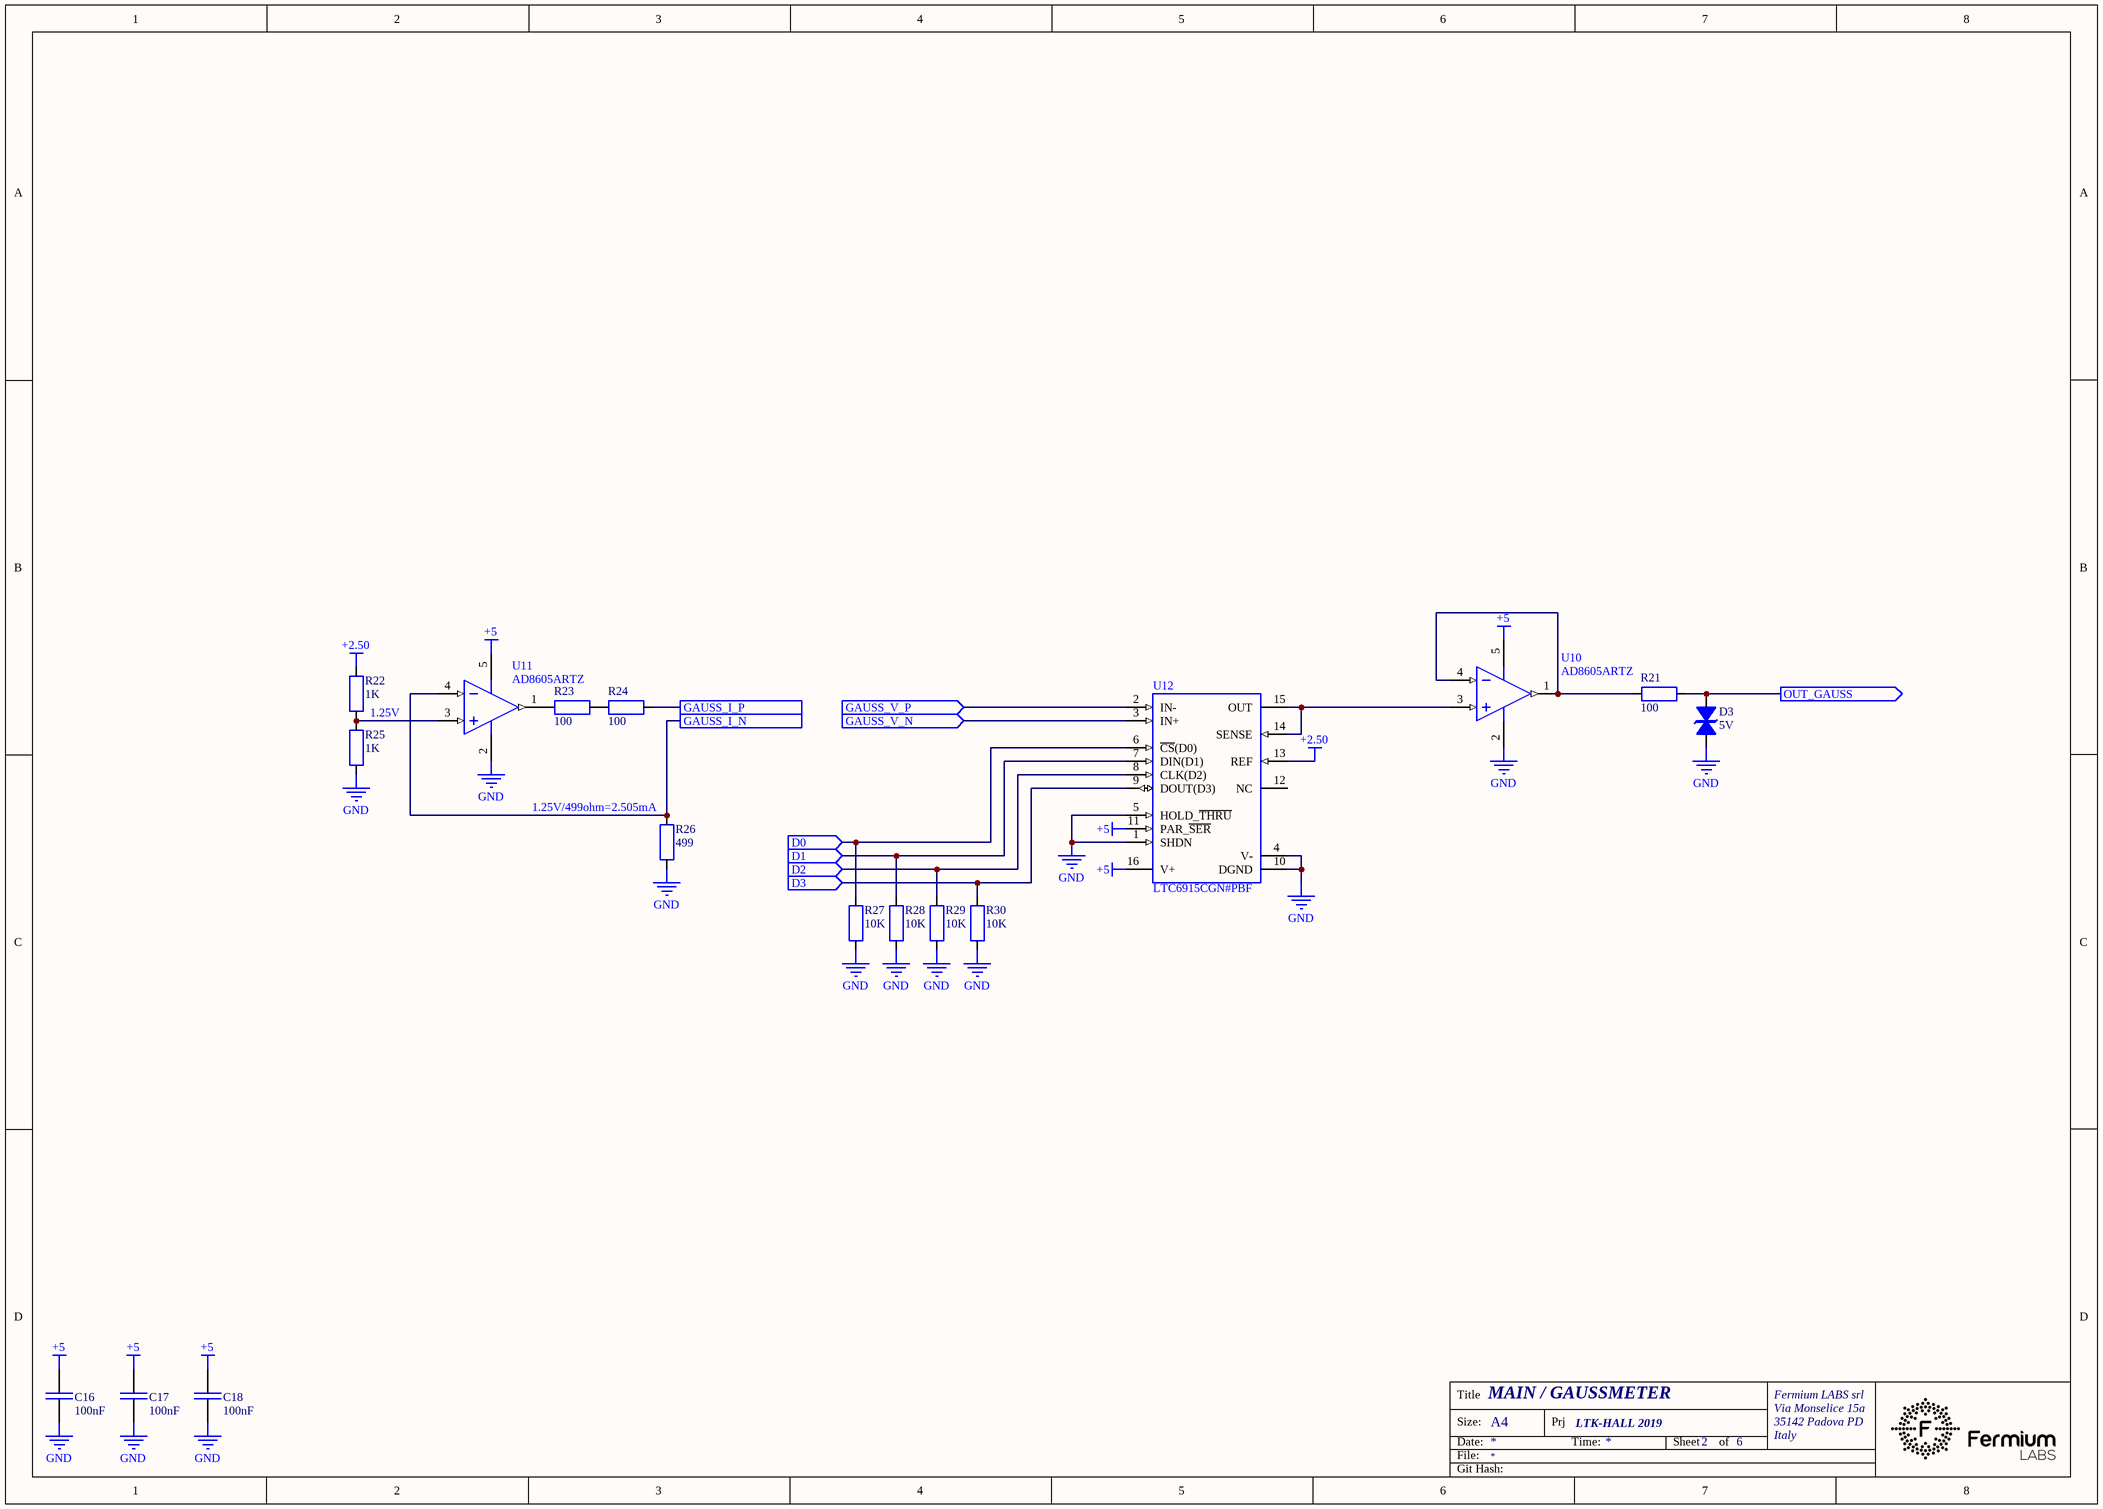
[diagram p2: ltk-hall_main_gauss.SchDoc]

### Parts
C16  100nF  [CAP 0603_1608]
C17  100nF  [CAP 0603_1608]
C18  100nF  [CAP 0603_1608]
D3  5V  [SOD523F]
R21  100  [RES 0603_1608]
R22  1K  [RES 0603_1608]
R23  100  [RES 0603_1608]
R24  100  [RES 0603_1608]
R25  1K  [RES 0603_1608]
R26  499  [RES 0603_1608]
R27  10K  [RES 0603_1608]
R28  10K  [RES 0603_1608]
R29  10K  [RES 0603_1608]
R30  10K  [RES 0603_1608]
U10  AD8605ARTZ  [A3DDA0BC-073E-4B18-9613-F713A7EC1E27]
U11  AD8605ARTZ  [A3DDA0BC-073E-4B18-9613-F713A7EC1E27]
U12  LTC6915CGN#PBF  [517EE8A2-9FD8-4174-996D-BDBF76CA3EEB]

### Ports
D0 (in), D1 (in), D2 (in), D3 (in), GAUSS_I_N, GAUSS_I_P, GAUSS_V_N (in), GAUSS_V_P (in), OUT_GAUSS (out)

### Nets
+2.50: R22.2 U12.13(REF)
+5: C16.1 C17.1 C18.1 U10.5(+V) U11.5(+V) U12.11(PAR_~{SER}) U12.16(V+)
GND: C16.2 C17.2 C18.2 D3.2 R25.1 R26.1 R27.1 R28.1 R29.1 R30.1 U10.2(-V) U11.2(-V) U12.1(SHDN) U12.4(V-) U12.5(HOLD_~{THRU}) U12.10(DGND)
NetD3_1: D3.1 R21.2 ; port OUT_GAUSS
NetP5_1: R26.2 U11.4(-IN) ; port GAUSS_I_N
NetP5_2: U12.2(IN-) ; port GAUSS_V_P
NetP5_3: U12.3(IN+) ; port GAUSS_V_N
NetP5_6: R24.2 ; port GAUSS_I_P
NetR21_1: R21.1 U10.1(OUT) U10.4(-IN)
NetR22_1: R22.1 R25.2 U11.3(+IN)
NetR23_1: R23.1 U11.1(OUT)
NetR23_2: R23.2 R24.1
NetR27_2: R27.2 U12.6(~{CS}(D0)) ; port D0
NetR28_2: R28.2 U12.7(DIN(D1)) ; port D1
NetR29_2: R29.2 U12.8(CLK(D2)) ; port D2
NetR30_2: R30.2 U12.9(DOUT(D3)) ; port D3
NetU10_3: U10.3(+IN) U12.14(SENSE) U12.15(OUT)

Not connected (* = marked no-connect by the designer): U12 12(NC)

### Notes on the sheet
- 1.25V
- (near R26) 1.25V/499ohm=2.505mA
- Title
- Fermium LABS srl
- Size:
- Date:
- File:
- A4
- Prj
- Time:
- Sheet
- of
- Via Monselice 15a
- 35142 Padova PD
- Italy
- Git Hash:

### Library data of the parts
C16-C18 = 02841f84-ac15-41b5-9e17-915f8f067828: as C7 on sheet ltk-hall_main; Part Number: 02841f84-ac15-41b5-9e17-915f8f067828; ComponentLink1Description: Datasheet; ComponentLink1URL: http://localhost:8080/static/files/Samsung-Electro-Mechanics-CL10B104KA8NNNC_C15902019-03-10_215548.826887.pdf?Samsung-Electro-Mechanics-CL10B104KA8NNNC_C1590.pdf; Value: 100nF; Manufacturer 2: Yageo; Manufacturer Part Number 2: CC0603KRX7R9BB104; S 2: LCSC
D3 = daa58212-38e2-4326-a156-8e48058c46f1: as D2 on sheet ltk-hall_main; Part Number: daa58212-38e2-4326-a156-8e48058c46f1; ComponentLink1Description: Datasheet; ComponentLink1URL: http://localhost:8080/static/files/Nexperia-PESD5V0S1BB-115_C976402019-08-16_201905.624024.pdf?Nexperia-PESD5V0S1BB-115_C97640.pdf; ComponentLink2Description: Datasheet; ComponentLink2URL: http://localhost:8080/static/files/1901051701_Bourne-Semicon-Shenzhen-PESD5V0S1BBN_C3142642019-08-16_201911.992552.pdf?1901051701_Bourne-Semicon-Shenzhen-PESD5V0S1BBN_C314264.pdf; Manufacturer 2: Nexperia; Manufacturer Part Number 2: PESD5V0S1BB,115; Value: 5V; S 2: LCSC
R21 R23 R24 = 0a6c4b74-f837-4563-b154-6e196d753525: as R3 on sheet ltk-hall_main; Part Number: 0a6c4b74-f837-4563-b154-6e196d753525; Value: 100; Manufacturer 2: Uniroyal; Manufacturer Part Number 2: 0603WAF1000T5E; S 2: LCSC
R22 R25 = a678220f-9e9d-4863-a833-9993504f723c: as R2 on sheet ltk-hall_main; Part Number: a678220f-9e9d-4863-a833-9993504f723c; Value: 1K; Manufacturer 2: Uniroyal; Manufacturer Part Number 2: 0603WAF1001T5E; S 2: LCSC
R26 = 3a10051a-dd65-4121-b0b9-1b40351a1843: RES SMD 499 OHM 1% 1/10W 0603; Manufacturer 1: Yageo; Manufacturer Part Number 1: RC0603FR-07499RL; id: 12368; S 1: LCSC; SPN 1: C23065; Part Number: 3a10051a-dd65-4121-b0b9-1b40351a1843; Value: 499; Manufacturer 2: Uniroyal; Manufacturer Part Number 2: 0603WAF4990T5E
R27-R30 = 93242766-ba1d-462d-b58f-ce1dfc4129c8: as R33 on sheet ltk-hall_main_igen; Part Number: 93242766-ba1d-462d-b58f-ce1dfc4129c8; Value: 10K; Manufacturer 2: Uniroyal; Manufacturer Part Number 2: 0603WAF1002T5E; S 2: LCSC
U10 U11 = 5610e9ea-bca8-49b2-8e5f-11409231f6a4: as U2 on sheet ltk-hall_main; Part Number: 5610e9ea-bca8-49b2-8e5f-11409231f6a4; ComponentLink1Description: Datasheet; ComponentLink1URL: http://localhost:8080/static/files/Analog_Devices-AD8605ARTZ-REEL7-datasheet2019-08-16_175825.352099.pdf?Analog_Devices-AD8605ARTZ-REEL7-datasheet.pdf; Manufacturer Part Number 1: AD8605ARTZ
U12 = 59fe82cd-fd18-4813-9f52-e2e78a460aff: IC PGA G0-4094 SPI-PARALLEL 5V RRIO SSOP-16; Manufacturer 1: Analog Devices; id: 14835; S 1: Mouser; SPN 1: 584-LTC6915CGN#PBF; Part Number: 59fe82cd-fd18-4813-9f52-e2e78a460aff; ComponentLink1Description: Datasheet; ComponentLink1URL: http://localhost:8080/static/files/Linear_Technology-LTC6915CDEPBF-datasheet2019-08-16_194420.284095.pdf?Linear_Technology-LTC6915CDE#PBF-datasheet.pdf; Manufacturer Part Number 1: LTC6915CGN#PBF

## Sheet ltk-hall_main_vh.SchDoc: MAIN / VHALL
size A3; Organization: Altium Limited; Address1: L3, 12a Rodborough Rd; Address2: Frenchs Forest; Address3: NSW; Address4: Australia 2086; DocumentNumber: 5; SheetNumber: 5; SheetTotal: 6
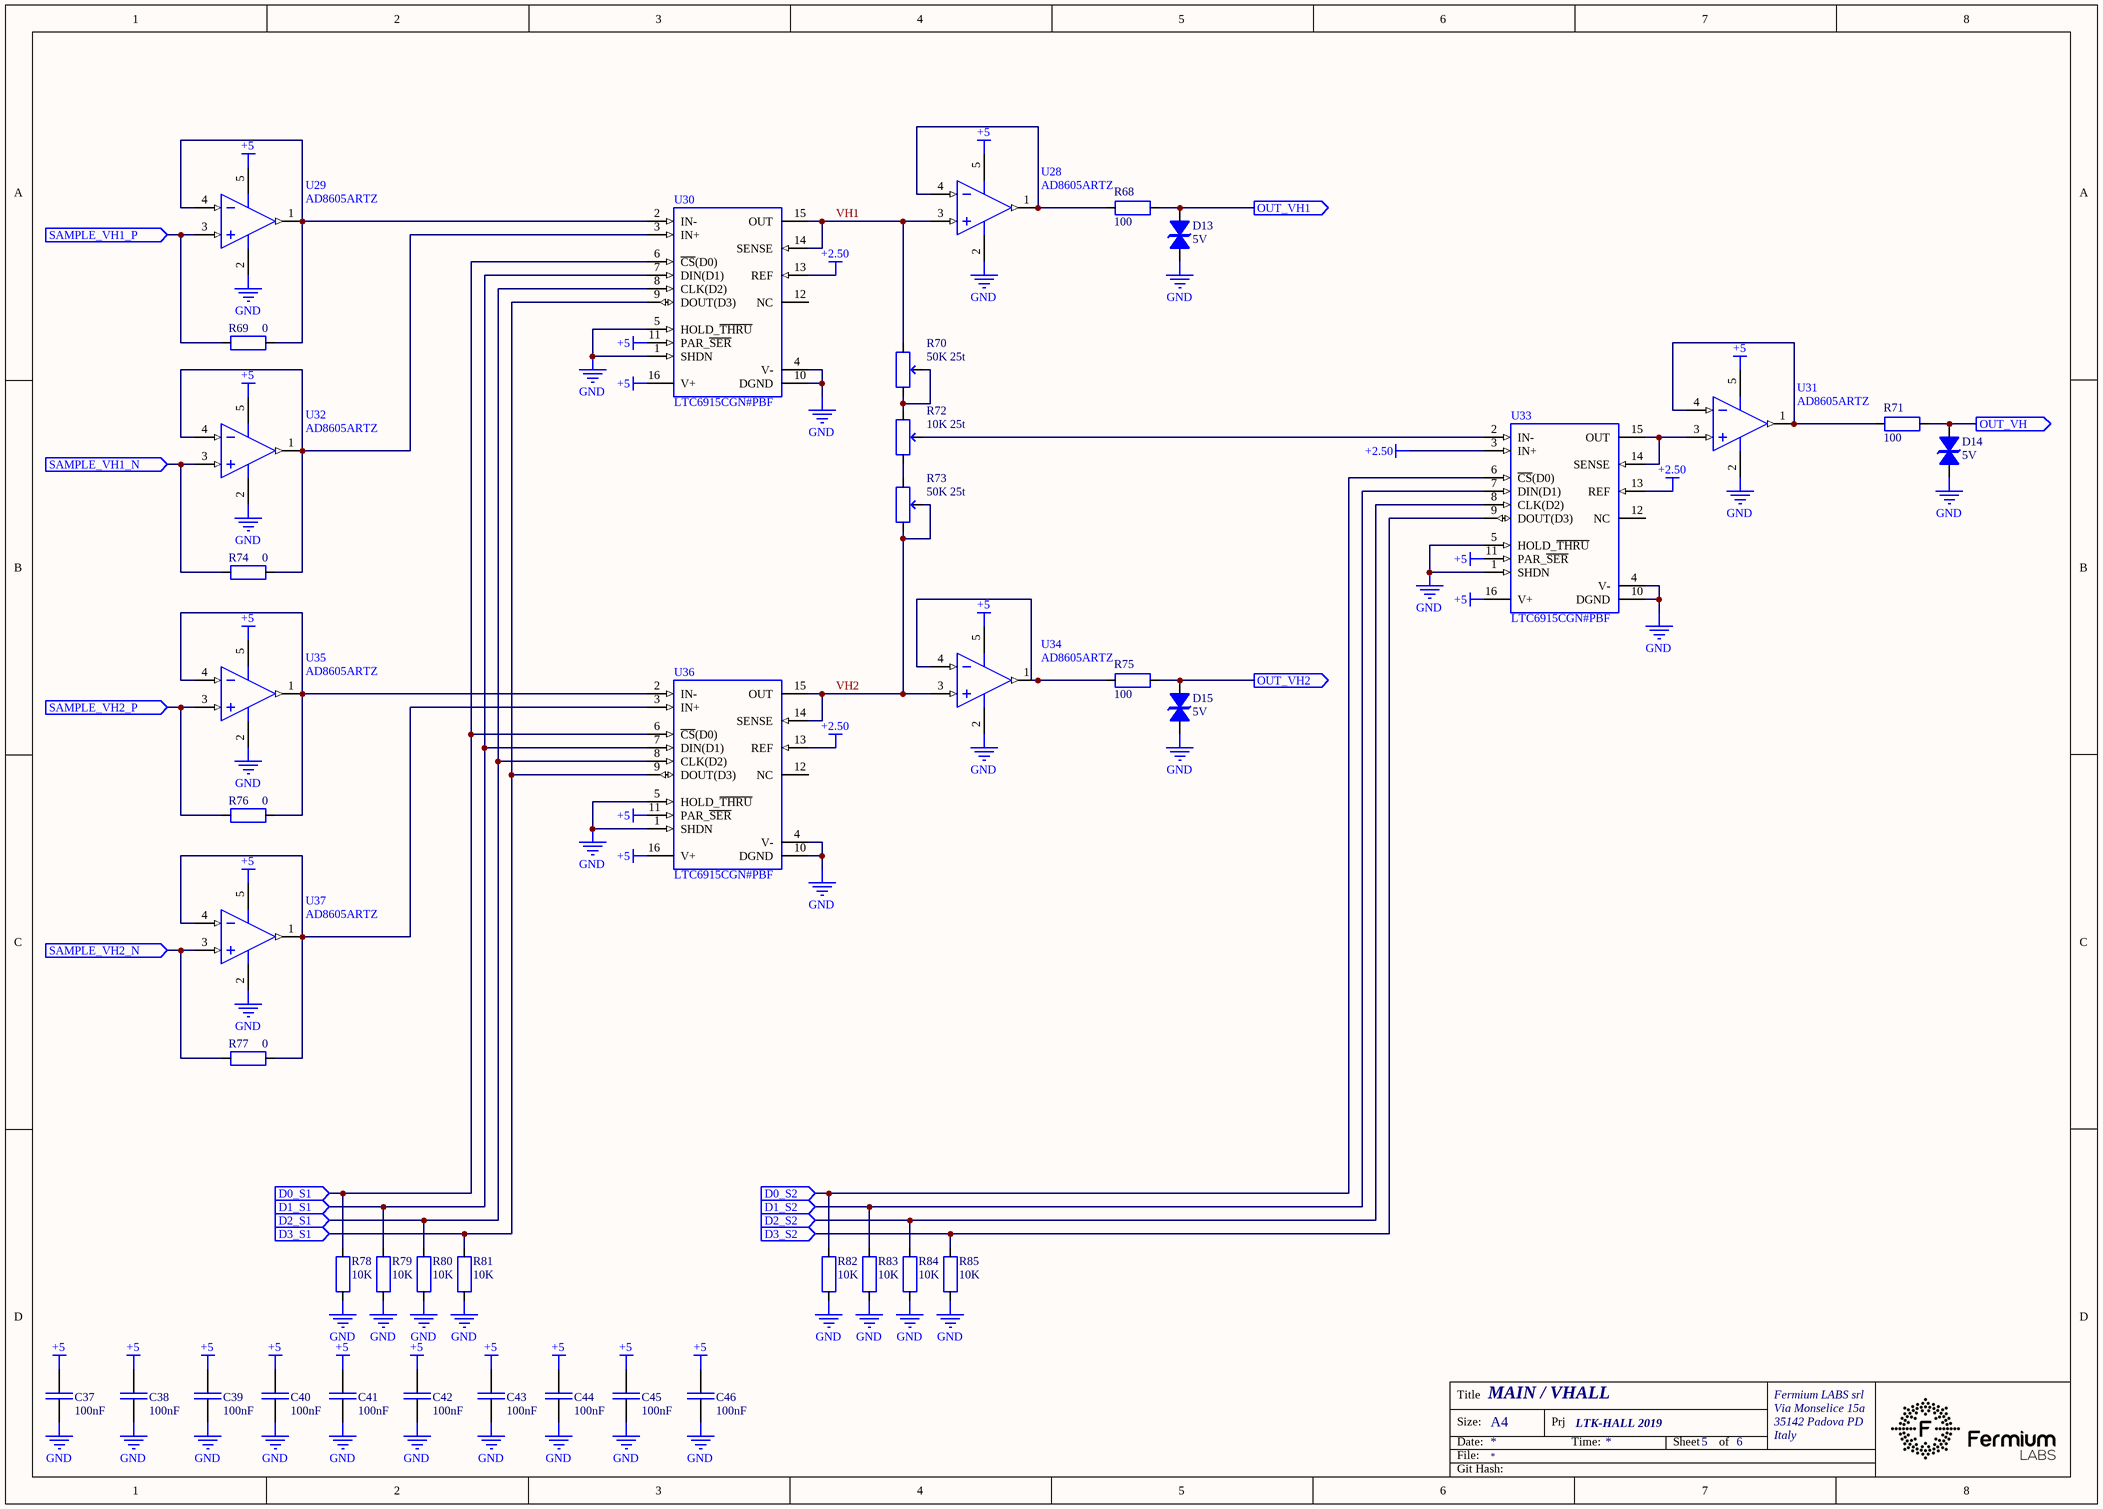
[diagram p3: ltk-hall_main_vh.SchDoc]

### Parts
C37  100nF  [CAP 0603_1608]
C38  100nF  [CAP 0603_1608]
C39  100nF  [CAP 0603_1608]
C40  100nF  [CAP 0603_1608]
C41  100nF  [CAP 0603_1608]
C42  100nF  [CAP 0603_1608]
C43  100nF  [CAP 0603_1608]
C44  100nF  [CAP 0603_1608]
C45  100nF  [CAP 0603_1608]
C46  100nF  [CAP 0603_1608]
D13  5V  [SOD523F]
D14  5V  [SOD523F]
D15  5V  [SOD523F]
R68  100  [RES 0603_1608]
R69  0  [RES 0603_1608]
R70  50K 25t  [F9540903-09ED-4909-856A-DED10E64451E]
R71  100  [RES 0603_1608]
R72  10K 25t  [F9540903-09ED-4909-856A-DED10E64451E]
R73  50K 25t  [F9540903-09ED-4909-856A-DED10E64451E]
R74  0  [RES 0603_1608]
R75  100  [RES 0603_1608]
R76  0  [RES 0603_1608]
R77  0  [RES 0603_1608]
R78  10K  [RES 0603_1608]
R79  10K  [RES 0603_1608]
R80  10K  [RES 0603_1608]
R81  10K  [RES 0603_1608]
R82  10K  [RES 0603_1608]
R83  10K  [RES 0603_1608]
R84  10K  [RES 0603_1608]
R85  10K  [RES 0603_1608]
U28  AD8605ARTZ  [A3DDA0BC-073E-4B18-9613-F713A7EC1E27]
U29  AD8605ARTZ  [A3DDA0BC-073E-4B18-9613-F713A7EC1E27]
U30  LTC6915CGN#PBF  [517EE8A2-9FD8-4174-996D-BDBF76CA3EEB]
U31  AD8605ARTZ  [A3DDA0BC-073E-4B18-9613-F713A7EC1E27]
U32  AD8605ARTZ  [A3DDA0BC-073E-4B18-9613-F713A7EC1E27]
U33  LTC6915CGN#PBF  [517EE8A2-9FD8-4174-996D-BDBF76CA3EEB]
U34  AD8605ARTZ  [A3DDA0BC-073E-4B18-9613-F713A7EC1E27]
U35  AD8605ARTZ  [A3DDA0BC-073E-4B18-9613-F713A7EC1E27]
U36  LTC6915CGN#PBF  [517EE8A2-9FD8-4174-996D-BDBF76CA3EEB]
U37  AD8605ARTZ  [A3DDA0BC-073E-4B18-9613-F713A7EC1E27]

### Ports
D0_S1 (in), D0_S2 (in), D1_S1 (in), D1_S2 (in), D2_S1 (in), D2_S2 (in), D3_S1 (in), D3_S2 (in), OUT_VH1 (out), OUT_VH2 (out), OUT_VH (out), SAMPLE_VH1_N (in), SAMPLE_VH1_P (in), SAMPLE_VH2_N (in), SAMPLE_VH2_P (in)

### Nets
+2.50: U30.13(REF) U33.3(IN+) U33.13(REF) U36.13(REF)
+5: C37.1 C38.1 C39.1 C40.1 C41.1 C42.1 C43.1 C44.1 C45.1 C46.1 U28.5(+V) U29.5(+V) U30.11(PAR_~{SER}) U30.16(V+) U31.5(+V) U32.5(+V) U33.11(PAR_~{SER}) U33.16(V+) U34.5(+V) U35.5(+V) U36.11(PAR_~{SER}) U36.16(V+) U37.5(+V)
GND: C37.2 C38.2 C39.2 C40.2 C41.2 C42.2 C43.2 C44.2 C45.2 C46.2 D13.2 D14.2 D15.2 R78.1 R79.1 R80.1 R81.1 R82.1 R83.1 R84.1 R85.1 U28.2(-V) U29.2(-V) U30.1(SHDN) U30.4(V-) U30.5(HOLD_~{THRU}) U30.10(DGND) U31.2(-V) U32.2(-V) U33.1(SHDN) U33.4(V-) U33.5(HOLD_~{THRU}) U33.10(DGND) U34.2(-V) U35.2(-V) U36.1(SHDN) U36.4(V-) U36.5(HOLD_~{THRU}) U36.10(DGND) U37.2(-V)
SAMPLE_VH1_N: R74.1 U32.3(+IN) ; port SAMPLE_VH1_N
SAMPLE_VH1_P: R69.1 U29.3(+IN) ; port SAMPLE_VH1_P
SAMPLE_VH2_N: R77.1 U37.3(+IN) ; port SAMPLE_VH2_N
SAMPLE_VH2_P: R76.1 U35.3(+IN) ; port SAMPLE_VH2_P
VH1: R70.1 U28.3(+IN) U30.14(SENSE) U30.15(OUT)
VH2: R73.2 R73.3 U34.3(+IN) U36.14(SENSE) U36.15(OUT)
NetD13_1: D13.1 R68.2 ; port OUT_VH1
NetD14_1: D14.1 R71.2 ; port OUT_VH
NetD15_1: D15.1 R75.2 ; port OUT_VH2
NetR68_1: R68.1 U28.1(OUT) U28.4(-IN)
NetR69_2: R69.2 U29.1(OUT) U29.4(-IN) U30.2(IN-)
NetR70_2: R70.2 R70.3 R72.3
NetR71_1: R71.1 U31.1(OUT) U31.4(-IN)
NetR72_1: R72.1 R73.1
NetR72_2: R72.2 U33.2(IN-)
NetR74_2: R74.2 U30.3(IN+) U32.1(OUT) U32.4(-IN)
NetR75_1: R75.1 U34.1(OUT) U34.4(-IN)
NetR76_2: R76.2 U35.1(OUT) U35.4(-IN) U36.2(IN-)
NetR77_2: R77.2 U36.3(IN+) U37.1(OUT) U37.4(-IN)
NetR78_2: R78.2 U30.6(~{CS}(D0)) U36.6(~{CS}(D0)) ; port D0_S1
NetR79_2: R79.2 U30.7(DIN(D1)) U36.7(DIN(D1)) ; port D1_S1
NetR80_2: R80.2 U30.8(CLK(D2)) U36.8(CLK(D2)) ; port D2_S1
NetR81_2: R81.2 U30.9(DOUT(D3)) U36.9(DOUT(D3)) ; port D3_S1
NetR82_2: R82.2 U33.6(~{CS}(D0)) ; port D0_S2
NetR83_2: R83.2 U33.7(DIN(D1)) ; port D1_S2
NetR84_2: R84.2 U33.8(CLK(D2)) ; port D2_S2
NetR85_2: R85.2 U33.9(DOUT(D3)) ; port D3_S2
NetU31_3: U31.3(+IN) U33.14(SENSE) U33.15(OUT)

Not connected (* = marked no-connect by the designer): U30 12(NC); U33 12(NC); U36 12(NC)

### Notes on the sheet
- Title
- Fermium LABS srl
- Size:
- Date:
- File:
- A4
- Prj
- Time:
- Sheet
- of
- Via Monselice 15a
- 35142 Padova PD
- Italy
- Git Hash:

### Library data of the parts
C37-C46 = 02841f84-ac15-41b5-9e17-915f8f067828: as C7 on sheet ltk-hall_main; Part Number: 02841f84-ac15-41b5-9e17-915f8f067828; ComponentLink1Description: Datasheet; ComponentLink1URL: http://localhost:8080/static/files/Samsung-Electro-Mechanics-CL10B104KA8NNNC_C15902019-03-10_215548.826887.pdf?Samsung-Electro-Mechanics-CL10B104KA8NNNC_C1590.pdf; Value: 100nF; Manufacturer 2: Yageo; Manufacturer Part Number 2: CC0603KRX7R9BB104; S 2: LCSC
D13-D15 = daa58212-38e2-4326-a156-8e48058c46f1: as D2 on sheet ltk-hall_main; Part Number: daa58212-38e2-4326-a156-8e48058c46f1; ComponentLink1Description: Datasheet; ComponentLink1URL: http://localhost:8080/static/files/Nexperia-PESD5V0S1BB-115_C976402019-08-16_201905.624024.pdf?Nexperia-PESD5V0S1BB-115_C97640.pdf; ComponentLink2Description: Datasheet; ComponentLink2URL: http://localhost:8080/static/files/1901051701_Bourne-Semicon-Shenzhen-PESD5V0S1BBN_C3142642019-08-16_201911.992552.pdf?1901051701_Bourne-Semicon-Shenzhen-PESD5V0S1BBN_C314264.pdf; Manufacturer 2: Nexperia; Manufacturer Part Number 2: PESD5V0S1BB,115; Value: 5V; S 2: LCSC
R68 R71 R75 = 0a6c4b74-f837-4563-b154-6e196d753525: as R3 on sheet ltk-hall_main; Part Number: 0a6c4b74-f837-4563-b154-6e196d753525; Value: 100; Manufacturer 2: Uniroyal; Manufacturer Part Number 2: 0603WAF1000T5E; S 2: LCSC
R69 R74 R76 R77 = 6ae227f9-847f-4766-8522-e11a83531204: as R4 on sheet ltk-hall_main; Part Number: 6ae227f9-847f-4766-8522-e11a83531204; Value: 0; Manufacturer 2: Uniroyal; Manufacturer Part Number 2: 0603WAF0000T5E; S 2: LCSC
R70 R73 = 90164141-8820-4471-9a6f-9a984ce9068c: POT TRIMMER LINEAR 50K 25TURNS VERT THT; Manufacturer 1: Bourns; Manufacturer Part Number 1: 3296W-1-503LF; id: 14849; S 1: LCSC; SPN 1: C83686; Part Number: 90164141-8820-4471-9a6f-9a984ce9068c; ComponentLink1Description: Datasheet; ComponentLink1URL: http://localhost:8080/static/files/BOURNS-3296W-1-103LF_C34846_12019-08-17_221926.713297.pdf?BOURNS-3296W-1-103LF_C34846 (1).pdf; Value: 50K 25t
R72 = 613f65ed-4d8d-44d0-9fe5-67eff78392c9: POT TRIMMER LINEAR 10K 25TURNS VERT THT; Manufacturer 1: Bourns; Manufacturer Part Number 1: 3296W-1-103LF; id: 14847; S 1: LCSC; SPN 1: C34846; Part Number: 613f65ed-4d8d-44d0-9fe5-67eff78392c9; ComponentLink1Description: 3D Model; ComponentLink1URL: http://localhost:8080/static/files/3296W_v12019-08-17_171307.552870.step?3296W v1.step; ComponentLink2Description: Datasheet; ComponentLink2URL: http://localhost:8080/static/files/BOURNS-3296W-1-103LF_C348462019-08-17_171320.734450.pdf?BOURNS-3296W-1-103LF_C34846.pdf; Value: 10K 25t
R78-R85 = 93242766-ba1d-462d-b58f-ce1dfc4129c8: as R33 on sheet ltk-hall_main_igen; Part Number: 93242766-ba1d-462d-b58f-ce1dfc4129c8; Value: 10K; Manufacturer 2: Uniroyal; Manufacturer Part Number 2: 0603WAF1002T5E; S 2: LCSC
U28 U29 U31 U32 U34 U35 U37 = 5610e9ea-bca8-49b2-8e5f-11409231f6a4: as U2 on sheet ltk-hall_main; Part Number: 5610e9ea-bca8-49b2-8e5f-11409231f6a4; ComponentLink1Description: Datasheet; ComponentLink1URL: http://localhost:8080/static/files/Analog_Devices-AD8605ARTZ-REEL7-datasheet2019-08-16_175825.352099.pdf?Analog_Devices-AD8605ARTZ-REEL7-datasheet.pdf; Manufacturer Part Number 1: AD8605ARTZ
U30 U33 U36 = 59fe82cd-fd18-4813-9f52-e2e78a460aff: as U12 on sheet ltk-hall_main_gauss; Part Number: 59fe82cd-fd18-4813-9f52-e2e78a460aff; ComponentLink1Description: Datasheet; ComponentLink1URL: http://localhost:8080/static/files/Linear_Technology-LTC6915CDEPBF-datasheet2019-08-16_194420.284095.pdf?Linear_Technology-LTC6915CDE#PBF-datasheet.pdf; Manufacturer Part Number 1: LTC6915CGN#PBF